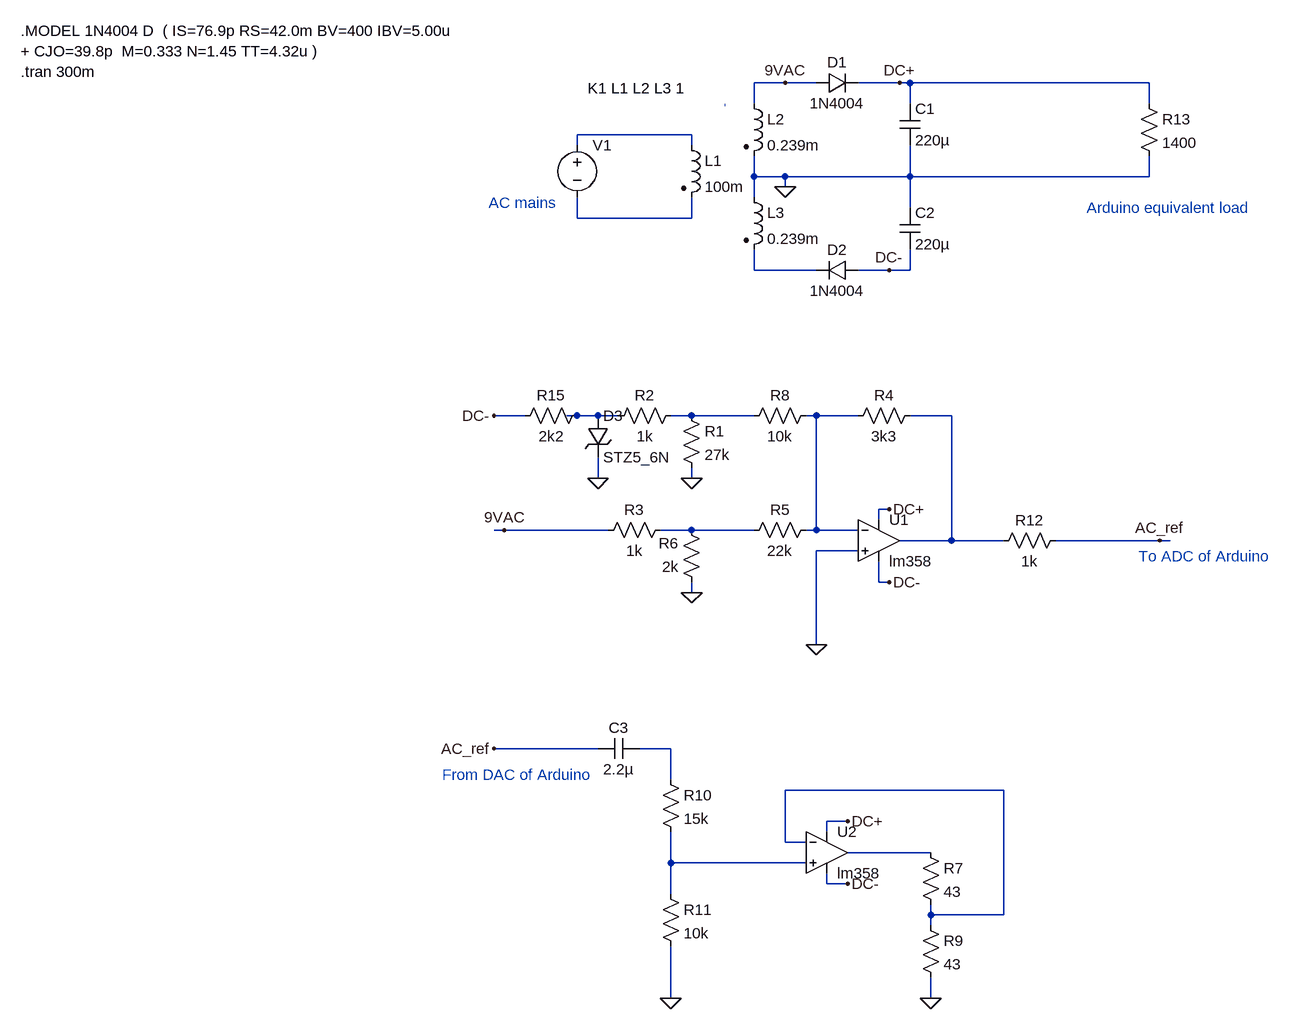
[diagram p0: schematic Simulated CT.asc]
Simulated CT.asc, the LTspice schematic file:
Version 4
SHEET 1 1652 1760
WIRE 224 80 176 80
WIRE 272 80 224 80
WIRE 400 80 336 80
WIRE 416 80 400 80
WIRE 784 80 416 80
WIRE 176 112 176 80
WIRE 416 112 416 80
WIRE 784 112 784 80
WIRE 80 160 -96 160
WIRE -96 176 -96 160
WIRE 80 176 80 160
WIRE 176 224 176 192
WIRE 224 224 176 224
WIRE 416 224 416 176
WIRE 416 224 224 224
WIRE 784 224 784 192
WIRE 784 224 416 224
WIRE 224 240 224 224
WIRE 176 256 176 224
WIRE 416 272 416 224
WIRE -96 288 -96 256
WIRE 80 288 80 256
WIRE 80 288 -96 288
WIRE 176 368 176 336
WIRE 272 368 176 368
WIRE 384 368 336 368
WIRE 416 368 416 336
WIRE 416 368 384 368
WIRE -176 592 -224 592
WIRE -96 592 -112 592
WIRE -64 592 -96 592
WIRE -32 592 -64 592
WIRE 80 592 48 592
WIRE 176 592 80 592
WIRE 272 592 256 592
WIRE 336 592 272 592
WIRE 480 592 416 592
WIRE -64 688 -64 656
WIRE 80 688 80 672
WIRE 384 736 368 736
WIRE 368 752 368 736
WIRE -208 768 -224 768
WIRE -48 768 -208 768
WIRE 80 768 32 768
WIRE 176 768 80 768
WIRE 272 768 272 592
WIRE 272 768 256 768
WIRE 336 768 272 768
WIRE 480 784 480 592
WIRE 480 784 400 784
WIRE 560 784 480 784
WIRE 800 784 640 784
WIRE 816 784 800 784
WIRE 336 800 272 800
WIRE 368 848 368 816
WIRE 384 848 368 848
WIRE 80 864 80 848
WIRE 272 944 272 800
WIRE -64 1104 -224 1104
WIRE 48 1104 0 1104
WIRE 48 1152 48 1104
WIRE 560 1168 224 1168
WIRE 320 1216 288 1216
WIRE 288 1232 288 1216
WIRE 224 1248 224 1168
WIRE 256 1248 224 1248
WIRE 448 1264 320 1264
WIRE 48 1280 48 1232
WIRE 256 1280 48 1280
WIRE 288 1312 288 1296
WIRE 320 1312 288 1312
WIRE 48 1328 48 1280
WIRE 448 1360 448 1344
WIRE 560 1360 560 1168
WIRE 560 1360 448 1360
WIRE 448 1376 448 1360
WIRE 48 1488 48 1408
WIRE 448 1488 448 1456
FLAG 224 240 0
FLAG 400 80 DC+
FLAG 272 944 0
FLAG 384 368 DC-
FLAG 224 80 9VAC
FLAG -64 688 0
FLAG 384 736 DC+
FLAG 384 848 DC-
FLAG 80 864 0
FLAG 80 688 0
FLAG 320 1216 DC+
FLAG 320 1312 DC-
FLAG 448 1488 0
FLAG -224 592 DC-
FLAG 48 1488 0
FLAG -224 1104 AC_ref
FLAG 800 784 AC_ref
FLAG -208 768 9VAC
SYMBOL ind2 64 160 R0
SYMATTR InstName L1
SYMATTR Value 100m
SYMATTR SpiceLine Rser=5
SYMBOL ind2 160 96 R0
SYMATTR InstName L2
SYMATTR Value 0.239m
SYMBOL ind2 160 240 R0
SYMATTR InstName L3
SYMATTR Value 0.239m
SYMBOL voltage -96 160 R0
WINDOW 3 24 96 Invisible 2
SYMATTR Value SINE(0 340 50 0 0 0 100)
SYMATTR InstName V1
SYMBOL diode 272 96 R270
WINDOW 0 32 32 VTop 2
WINDOW 3 0 32 VBottom 2
SYMATTR InstName D1
SYMATTR Value 1N4004
SYMBOL diode 336 352 R90
WINDOW 0 0 32 VBottom 2
WINDOW 3 32 32 VTop 2
SYMATTR InstName D2
SYMATTR Value 1N4004
SYMBOL cap 400 112 R0
SYMATTR InstName C1
SYMATTR Value 220µ
SYMBOL cap 400 272 R0
SYMATTR InstName C2
SYMATTR Value 220µ
SYMBOL lm358 368 720 R0
SYMATTR InstName U1
SYMBOL res 432 576 R90
WINDOW 0 0 56 VBottom 2
WINDOW 3 32 56 VTop 2
SYMATTR InstName R4
SYMATTR Value 3k3
SYMBOL res 272 752 R90
WINDOW 0 0 56 VBottom 2
WINDOW 3 32 56 VTop 2
SYMATTR InstName R5
SYMATTR Value 22k
SYMBOL res 272 576 R90
WINDOW 0 0 56 VBottom 2
WINDOW 3 32 56 VTop 2
SYMATTR InstName R8
SYMATTR Value 10k
SYMBOL res 64 576 R0
SYMATTR InstName R1
SYMATTR Value 27k
SYMBOL res 64 576 R90
WINDOW 0 0 56 VBottom 2
WINDOW 3 32 56 VTop 2
SYMATTR InstName R2
SYMATTR Value 1k
SYMBOL res 48 752 R90
WINDOW 0 0 56 VBottom 2
WINDOW 3 32 56 VTop 2
SYMATTR InstName R3
SYMATTR Value 1k
SYMBOL res 96 864 R180
WINDOW 0 36 76 Left 2
WINDOW 3 36 40 Left 2
SYMATTR InstName R6
SYMATTR Value 2k
SYMBOL lm358 288 1200 R0
SYMATTR InstName U2
SYMBOL res 432 1248 R0
SYMATTR InstName R7
SYMATTR Value 43
SYMBOL res 432 1360 R0
SYMATTR InstName R9
SYMATTR Value 43
SYMBOL zener -80 592 R0
SYMATTR InstName D3
SYMATTR Value STZ5_6N
SYMBOL res -80 576 R90
WINDOW 0 0 56 VBottom 2
WINDOW 3 32 56 VTop 2
SYMATTR InstName R15
SYMATTR Value 2k2
SYMBOL cap 0 1088 R90
WINDOW 0 0 32 VBottom 2
WINDOW 3 32 32 VTop 2
SYMATTR InstName C3
SYMATTR Value 2.2µ
SYMBOL res 32 1136 R0
SYMATTR InstName R10
SYMATTR Value 15k
SYMBOL res 32 1312 R0
SYMATTR InstName R11
SYMATTR Value 10k
SYMBOL res 768 96 R0
SYMATTR InstName R13
SYMATTR Value 1400
SYMBOL res 656 768 R90
WINDOW 0 0 56 VBottom 2
WINDOW 3 32 56 VTop 2
SYMATTR InstName R12
SYMATTR Value 1k
TEXT -80 88 Left 2 !K1 L1 L2 L3 1
TEXT -952 0 Left 2 !.MODEL 1N4004 D  ( IS=76.9p RS=42.0m BV=400 IBV=5.00u\n+ CJO=39.8p  M=0.333 N=1.45 TT=4.32u )\n.tran 300m
TEXT 688 272 Left 2 ;Arduino equivalent load
TEXT 768 808 Left 2 ;To ADC of Arduino
TEXT -304 1144 Left 2 ;From DAC of Arduino
TEXT -232 264 Left 2 ;AC mains
LINE Normal 132 116 132 112 2

The netlist it stands for:
* Simulated CT.asc
L1 N001 N002 100m Rser=5
L2 9VAC 0 0.239m
L3 0 N003 0.239m
V1 N001 N002 SINE(0 340 50 0 0 0 100)
D1 9VAC DC+ 1N4004
D2 DC- N003 1N4004
C1 DC+ 0 220µ
C2 0 DC- 220µ
* U1: lm358 (symbol lm358 not available, pins judged from their places): In+=0 In-=N006 V+=DC+ V-=DC- OUT=N007
R4 N007 N006 3k3
R5 N006 N008 22k
R8 N006 N005 10k
R1 N005 0 27k
R2 N005 N004 1k
R3 N008 9VAC 1k
R6 0 N008 2k
* U2: lm358 (symbol lm358 not available, pins judged from their places): In+=N012 In-=N010 V+=DC+ V-=DC- OUT=N011
R7 N011 N010 43
R9 N010 0 43
D3 N004 0 STZ5_6N
R15 N004 DC- 2k2
C3 N009 AC_ref 2.2µ
R10 N009 N012 15k
R11 N012 0 10k
R13 DC+ 0 1400
R12 AC_ref N007 1k
.model D D
.lib standard.dio
K1 L1 L2 L3 1
.MODEL 1N4004 D  ( IS=76.9p RS=42.0m BV=400 IBV=5.00u
+ CJO=39.8p  M=0.333 N=1.45 TT=4.32u )
.tran 300m
* Arduino equivalent load
* To ADC of Arduino
* From DAC of Arduino
* AC mains
.backanno
.end